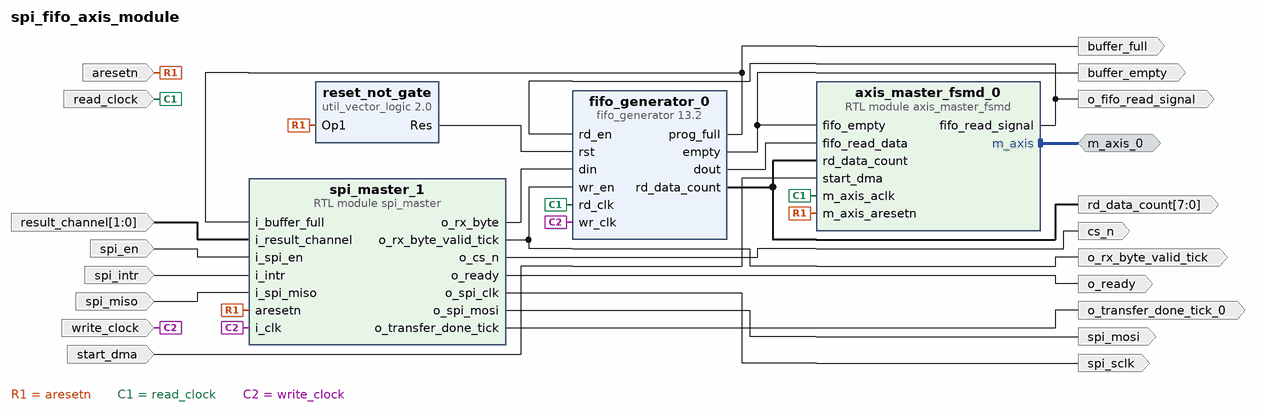
[diagram p0: block diagram of the top level]
# Vivado block design spi_fifo_axis_module, xc7z020clg484-1, Vivado 2024.2
create_bd_design spi_fifo_axis_module

create_bd_intf_port -mode Master -vlnv xilinx.com:interface:axis_rtl:1.0 m_axis_0
create_bd_port -dir I aresetn
create_bd_port -dir I -type clk read_clock
set_property -dict {CONFIG.ASSOCIATED_BUSIF m_axis_0 CONFIG.FREQ_HZ 100000000} [get_bd_ports read_clock]
create_bd_port -dir I spi_miso
create_bd_port -dir O spi_mosi
create_bd_port -dir O -type clk spi_sclk
create_bd_port -dir I -type clk write_clock
set_property -dict {CONFIG.FREQ_HZ 100000000} [get_bd_ports write_clock]
create_bd_port -dir I spi_intr
create_bd_port -dir I spi_en
create_bd_port -dir O cs_n
create_bd_port -dir O buffer_full
create_bd_port -dir O buffer_empty
create_bd_port -dir O o_transfer_done_tick_0
create_bd_port -dir O o_rx_byte_valid_tick
create_bd_port -dir O o_ready
create_bd_port -dir O o_fifo_read_signal
create_bd_port -dir O -from 7 -to 0 rd_data_count
create_bd_port -dir I start_dma
create_bd_port -dir I -from 1 -to 0 result_channel

create_bd_cell -type ip -vlnv xilinx.com:ip:fifo_generator:13.2 fifo_generator_0
set_property -dict [list \
  CONFIG.Almost_Empty_Flag false \
  CONFIG.Almost_Full_Flag false \
  CONFIG.Enable_Reset_Synchronization true \
  CONFIG.Enable_Safety_Circuit true \
  CONFIG.Fifo_Implementation Independent_Clocks_Block_RAM \
  CONFIG.Full_Flags_Reset_Value 1 \
  CONFIG.Full_Threshold_Assert_Value 1000 \
  CONFIG.Input_Data_Width 8 \
  CONFIG.Output_Data_Width 32 \
  CONFIG.Performance_Options Standard_FIFO \
  CONFIG.Programmable_Empty_Type No_Programmable_Empty_Threshold \
  CONFIG.Programmable_Full_Type Single_Programmable_Full_Threshold_Constant \
  CONFIG.Read_Data_Count true \
  CONFIG.Read_Data_Count_Width 8 \
  CONFIG.Write_Acknowledge_Flag false \
  CONFIG.Write_Data_Count false \
] [get_bd_cells fifo_generator_0]
create_bd_cell -type ip -vlnv xilinx.com:ip:util_vector_logic:2.0 reset_not_gate
set_property -dict {CONFIG.C_OPERATION not CONFIG.C_SIZE 1} [get_bd_cells reset_not_gate]
create_bd_cell -type module -reference spi_master spi_master_1
create_bd_cell -type module -reference axis_master_fsmd axis_master_fsmd_0

# ---- connections ----

connect_bd_intf_net [get_bd_intf_ports m_axis_0] [get_bd_intf_pins axis_master_fsmd_0/m_axis]
connect_bd_net [get_bd_ports aresetn] \
  [get_bd_pins reset_not_gate/Op1] [get_bd_pins axis_master_fsmd_0/m_axis_aresetn] [get_bd_pins spi_master_1/aresetn]
connect_bd_net -net axi_stream_master_0_fifo_read_en [get_bd_pins axis_master_fsmd_0/fifo_read_signal] \
  [get_bd_ports o_fifo_read_signal] [get_bd_pins fifo_generator_0/rd_en]
connect_bd_net [get_bd_pins fifo_generator_0/dout] [get_bd_pins axis_master_fsmd_0/fifo_read_data]
connect_bd_net [get_bd_pins fifo_generator_0/empty] [get_bd_ports buffer_empty] [get_bd_pins axis_master_fsmd_0/fifo_empty]
connect_bd_net [get_bd_pins fifo_generator_0/prog_full] [get_bd_ports buffer_full] [get_bd_pins spi_master_1/i_buffer_full]
connect_bd_net [get_bd_pins fifo_generator_0/rd_data_count] [get_bd_ports rd_data_count] [get_bd_pins axis_master_fsmd_0/rd_data_count]
connect_bd_net -net i_result_channel_0_1 [get_bd_ports result_channel] [get_bd_pins spi_master_1/i_result_channel]
connect_bd_net [get_bd_ports read_clock] [get_bd_pins fifo_generator_0/rd_clk] [get_bd_pins axis_master_fsmd_0/m_axis_aclk]
connect_bd_net [get_bd_ports spi_en] [get_bd_pins spi_master_1/i_spi_en]
connect_bd_net [get_bd_ports spi_intr] [get_bd_pins spi_master_1/i_intr]
connect_bd_net [get_bd_pins spi_master_1/o_rx_byte] [get_bd_pins fifo_generator_0/din]
connect_bd_net [get_bd_pins spi_master_1/o_spi_clk] [get_bd_ports spi_sclk]
connect_bd_net [get_bd_pins spi_master_1/o_spi_mosi] [get_bd_ports spi_mosi]
connect_bd_net -net spi_master_1_o_byte_done_tick [get_bd_pins spi_master_1/o_rx_byte_valid_tick] \
  [get_bd_ports o_rx_byte_valid_tick] [get_bd_pins fifo_generator_0/wr_en]
connect_bd_net [get_bd_pins spi_master_1/o_cs_n] [get_bd_ports cs_n]
connect_bd_net [get_bd_pins spi_master_1/o_ready] [get_bd_ports o_ready]
connect_bd_net [get_bd_pins spi_master_1/o_transfer_done_tick] [get_bd_ports o_transfer_done_tick_0]
connect_bd_net [get_bd_ports spi_miso] [get_bd_pins spi_master_1/i_spi_miso]
connect_bd_net -net start_dma_0_1 [get_bd_ports start_dma] [get_bd_pins axis_master_fsmd_0/start_dma]
connect_bd_net -net util_vector_logic_0_Res [get_bd_pins reset_not_gate/Res] [get_bd_pins fifo_generator_0/rst]
connect_bd_net [get_bd_ports write_clock] [get_bd_pins fifo_generator_0/wr_clk] [get_bd_pins spi_master_1/i_clk]

validate_bd_design
save_bd_design
